# Altium schematic sheet Top Sheet.SchDoc: Top Sheet
size A3; Date: 09-Sep-2021; CheckedBy: NA; Author: Deepak Reddy; CompanyName: www.logicboards.org; DrawnBy: Deepak Reddy; Revision: 1.0.0; SheetNumber: 1; SheetTotal: 8
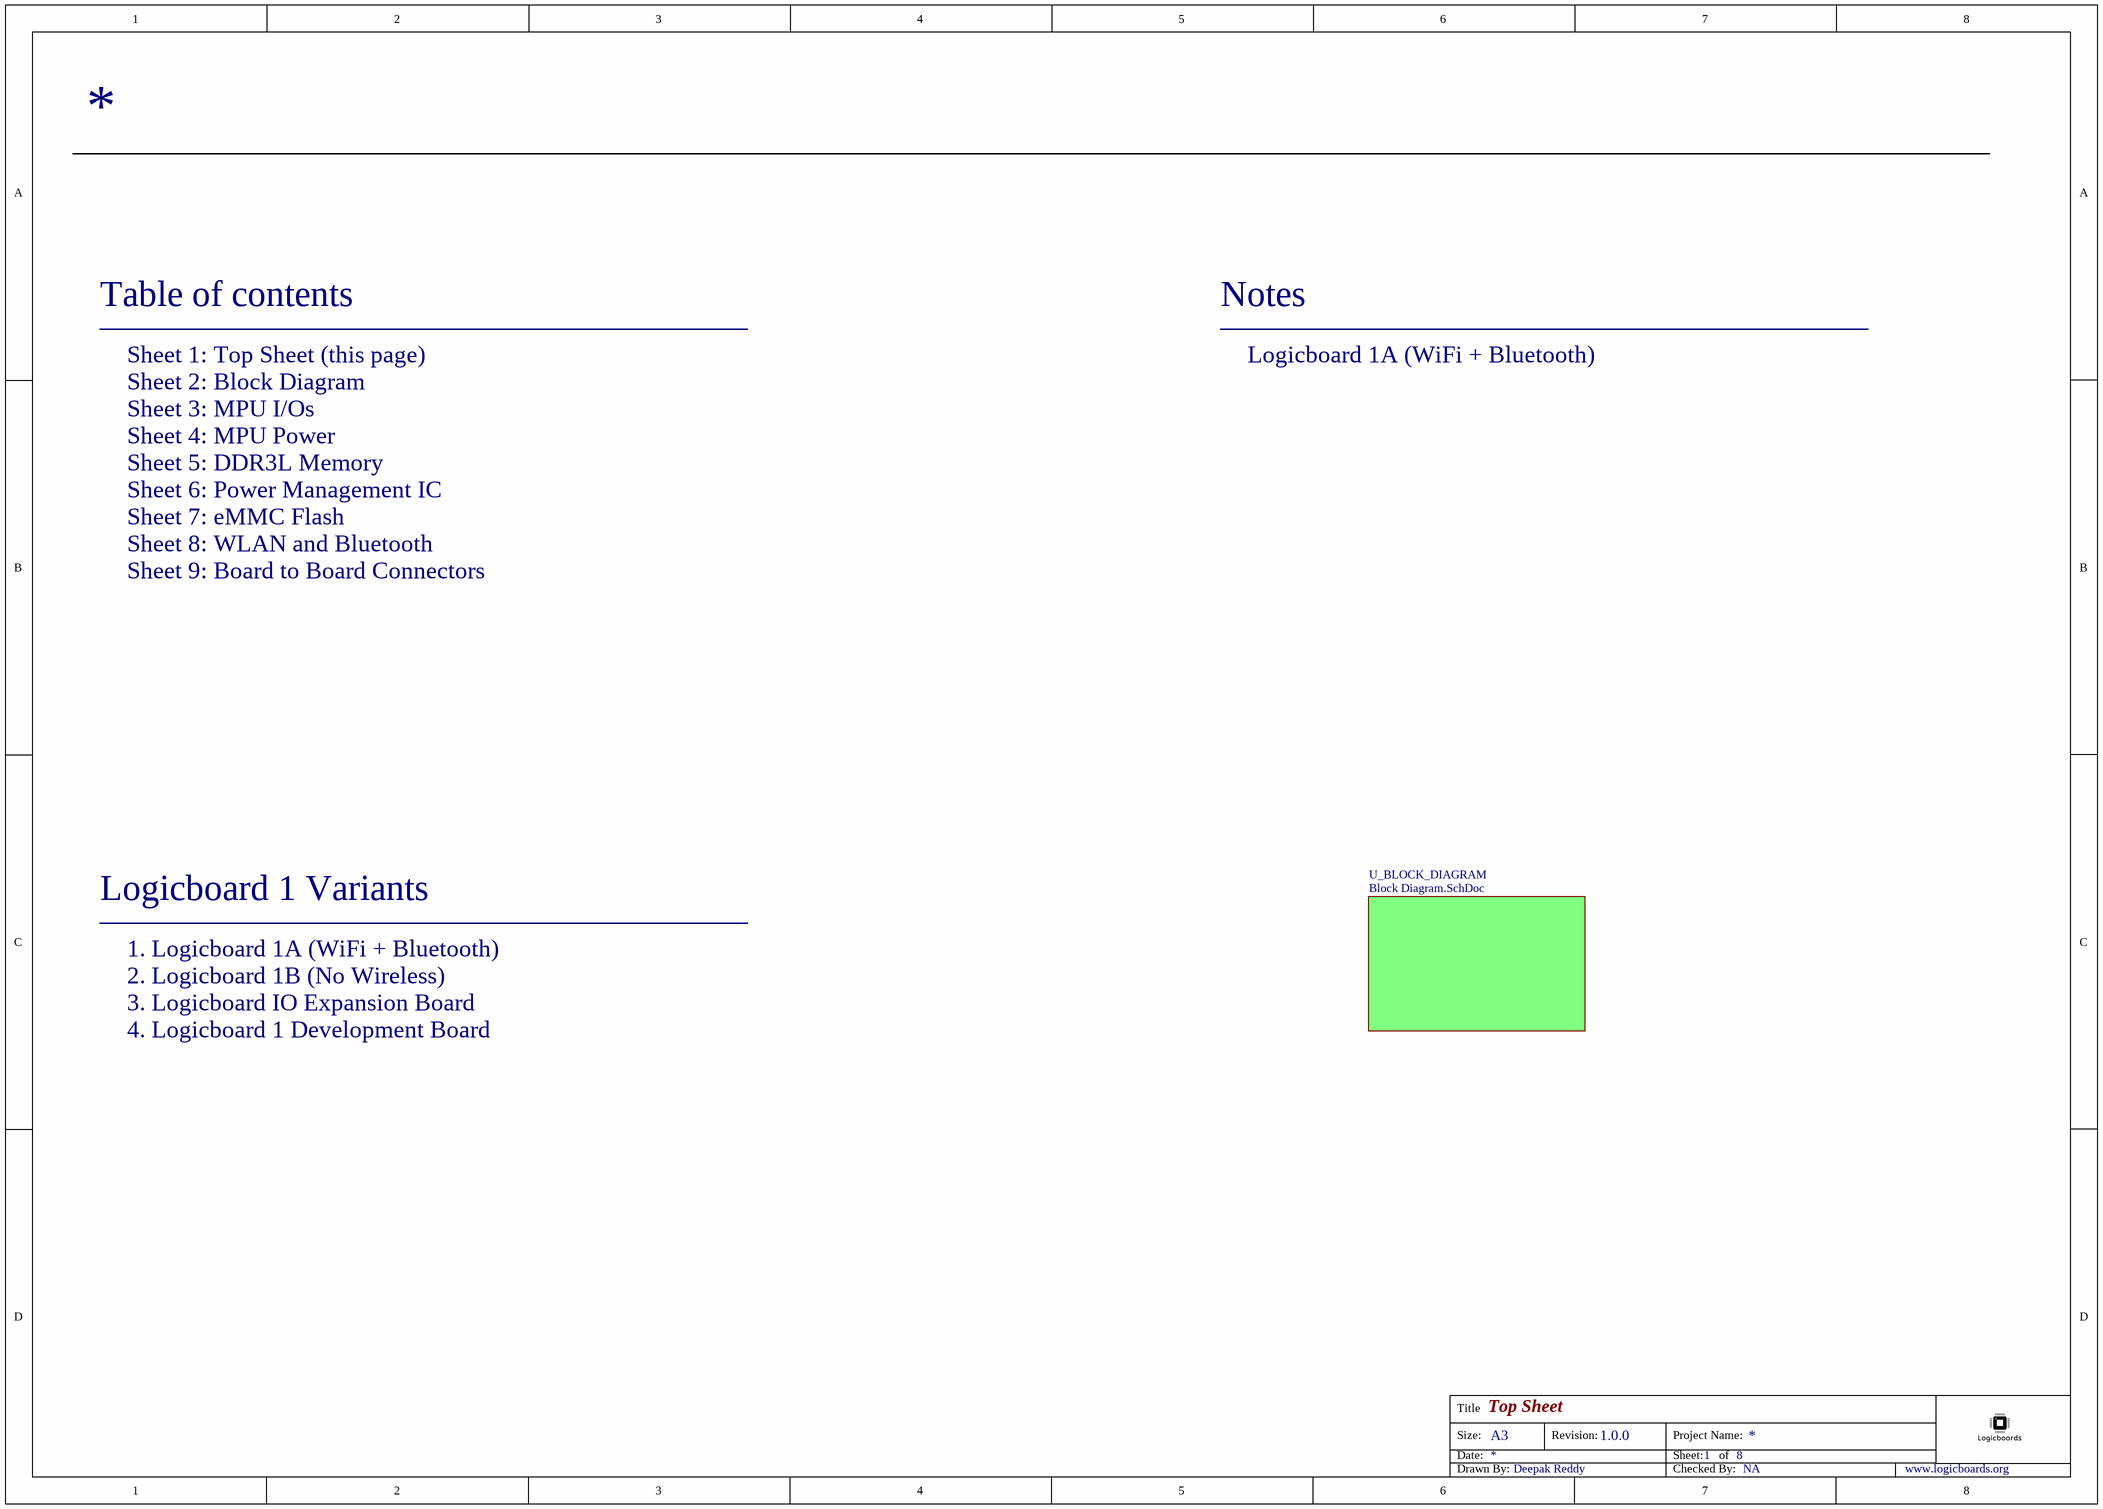
[diagram p0: Top Sheet.SchDoc]

## Sub-sheets
U_BLOCK_DIAGRAM = Block Diagram.SchDoc: no entries

## Notes on the sheet
- Table of contents
- Notes
- Sheet 1: Top Sheet (this page)
- Logicboard 1A (WiFi + Bluetooth)
- Sheet 2: Block Diagram
- Sheet 3: MPU I/Os
- Sheet 4: MPU Power
- Sheet 6: Power Management IC
- Sheet 5: DDR3L Memory
- Sheet 8: WLAN and Bluetooth
- Sheet 7: eMMC Flash
- Sheet 9: Board to Board Connectors
- Logicboard 1 Variants
- 1. Logicboard 1A (WiFi + Bluetooth)
- 2. Logicboard 1B (No Wireless)
- 3. Logicboard IO Expansion Board
- 4. Logicboard 1 Development Board
- Title
- Size:
- Date:
- A3
- Revision:
- Project Name:
- Sheet:
- of
- Drawn By:
- Checked By:
- www.logicboards.org